# Altium project TFTAdapter v1.PrjPCB
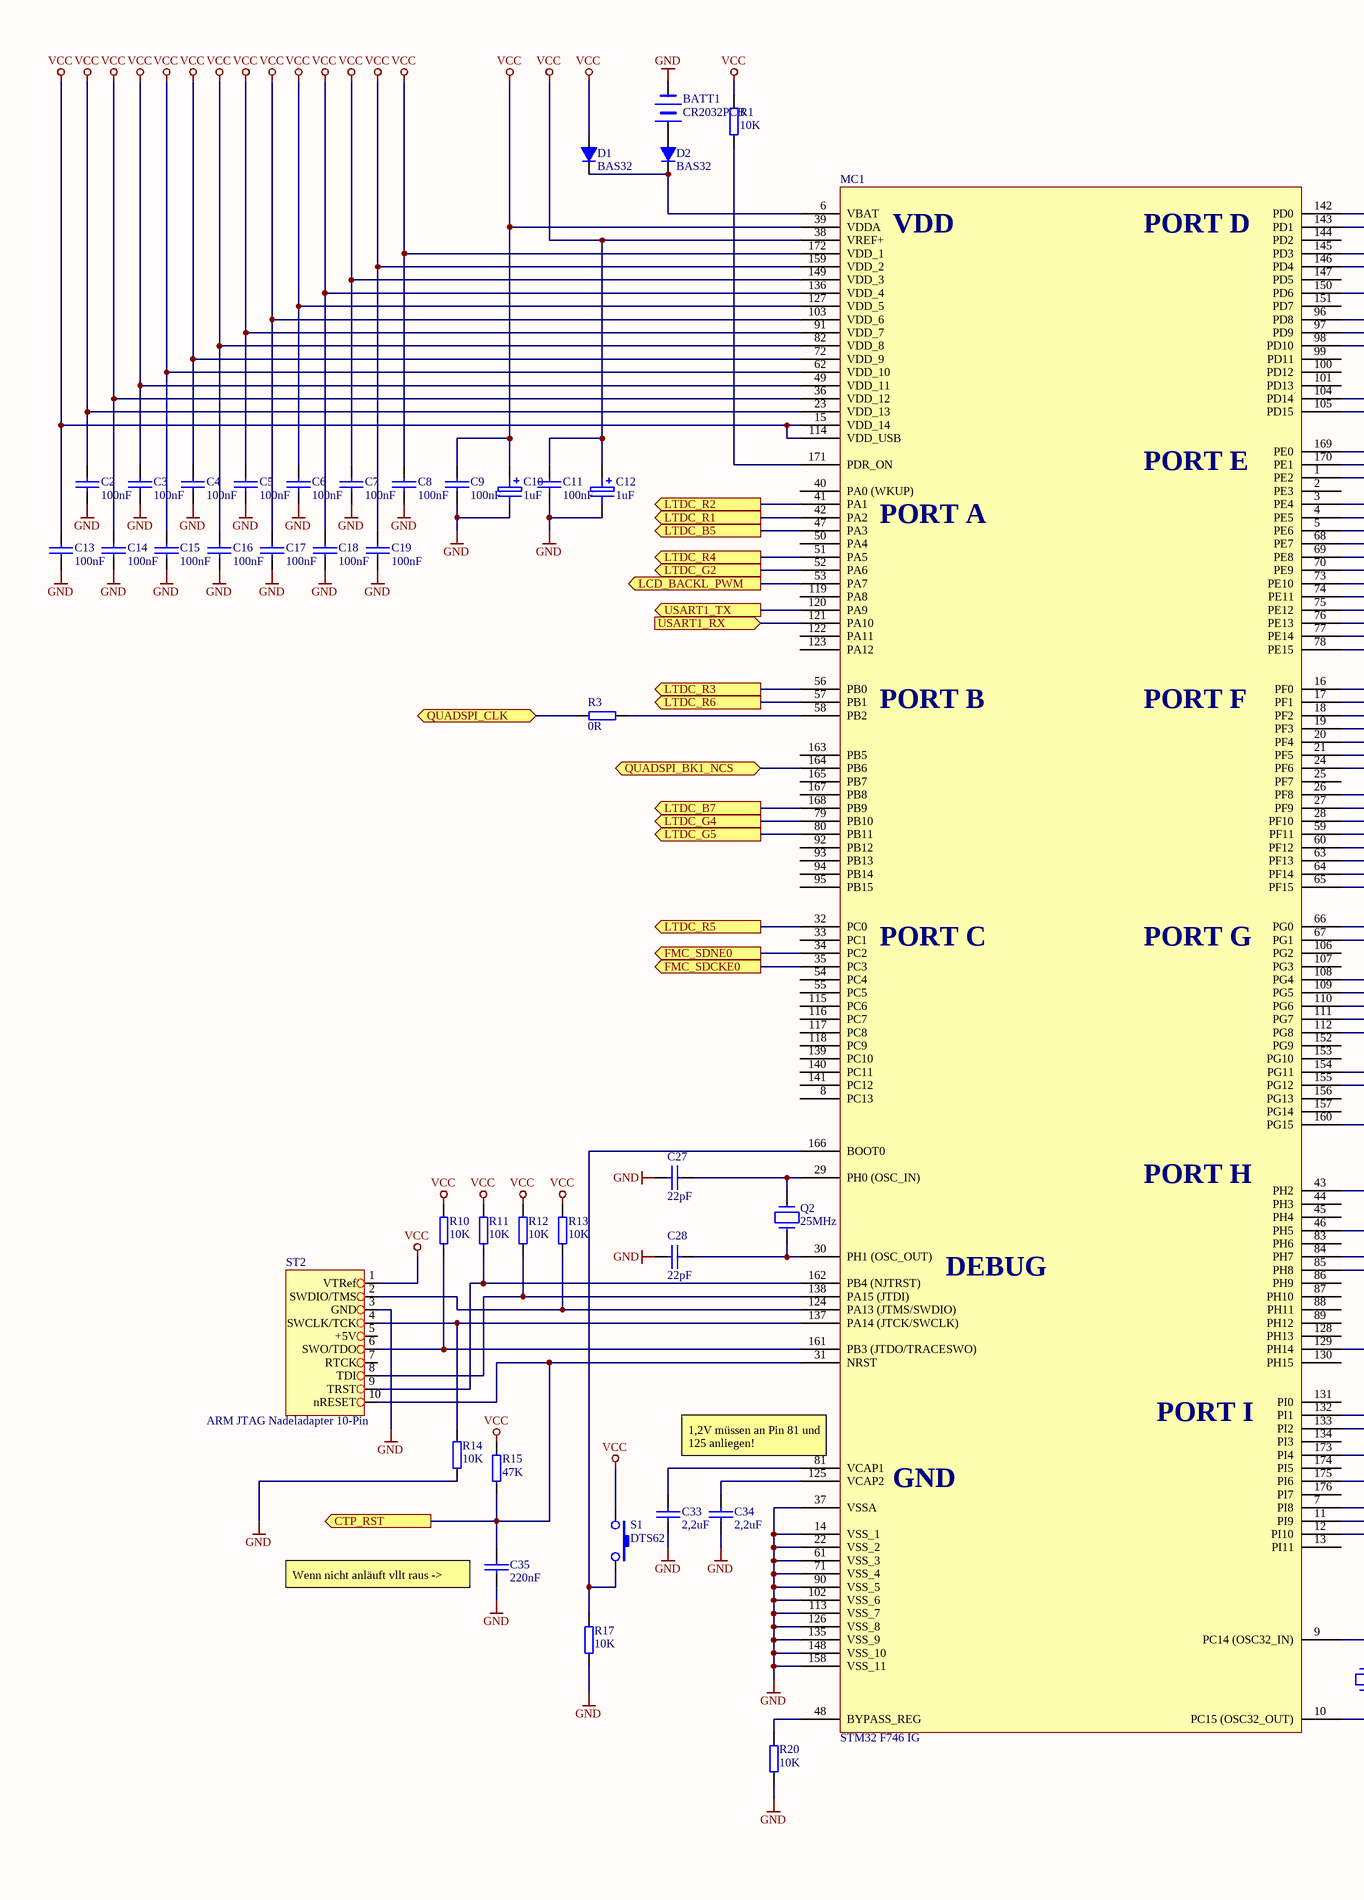
[diagram p0: Prozessor.SchDoc, left]
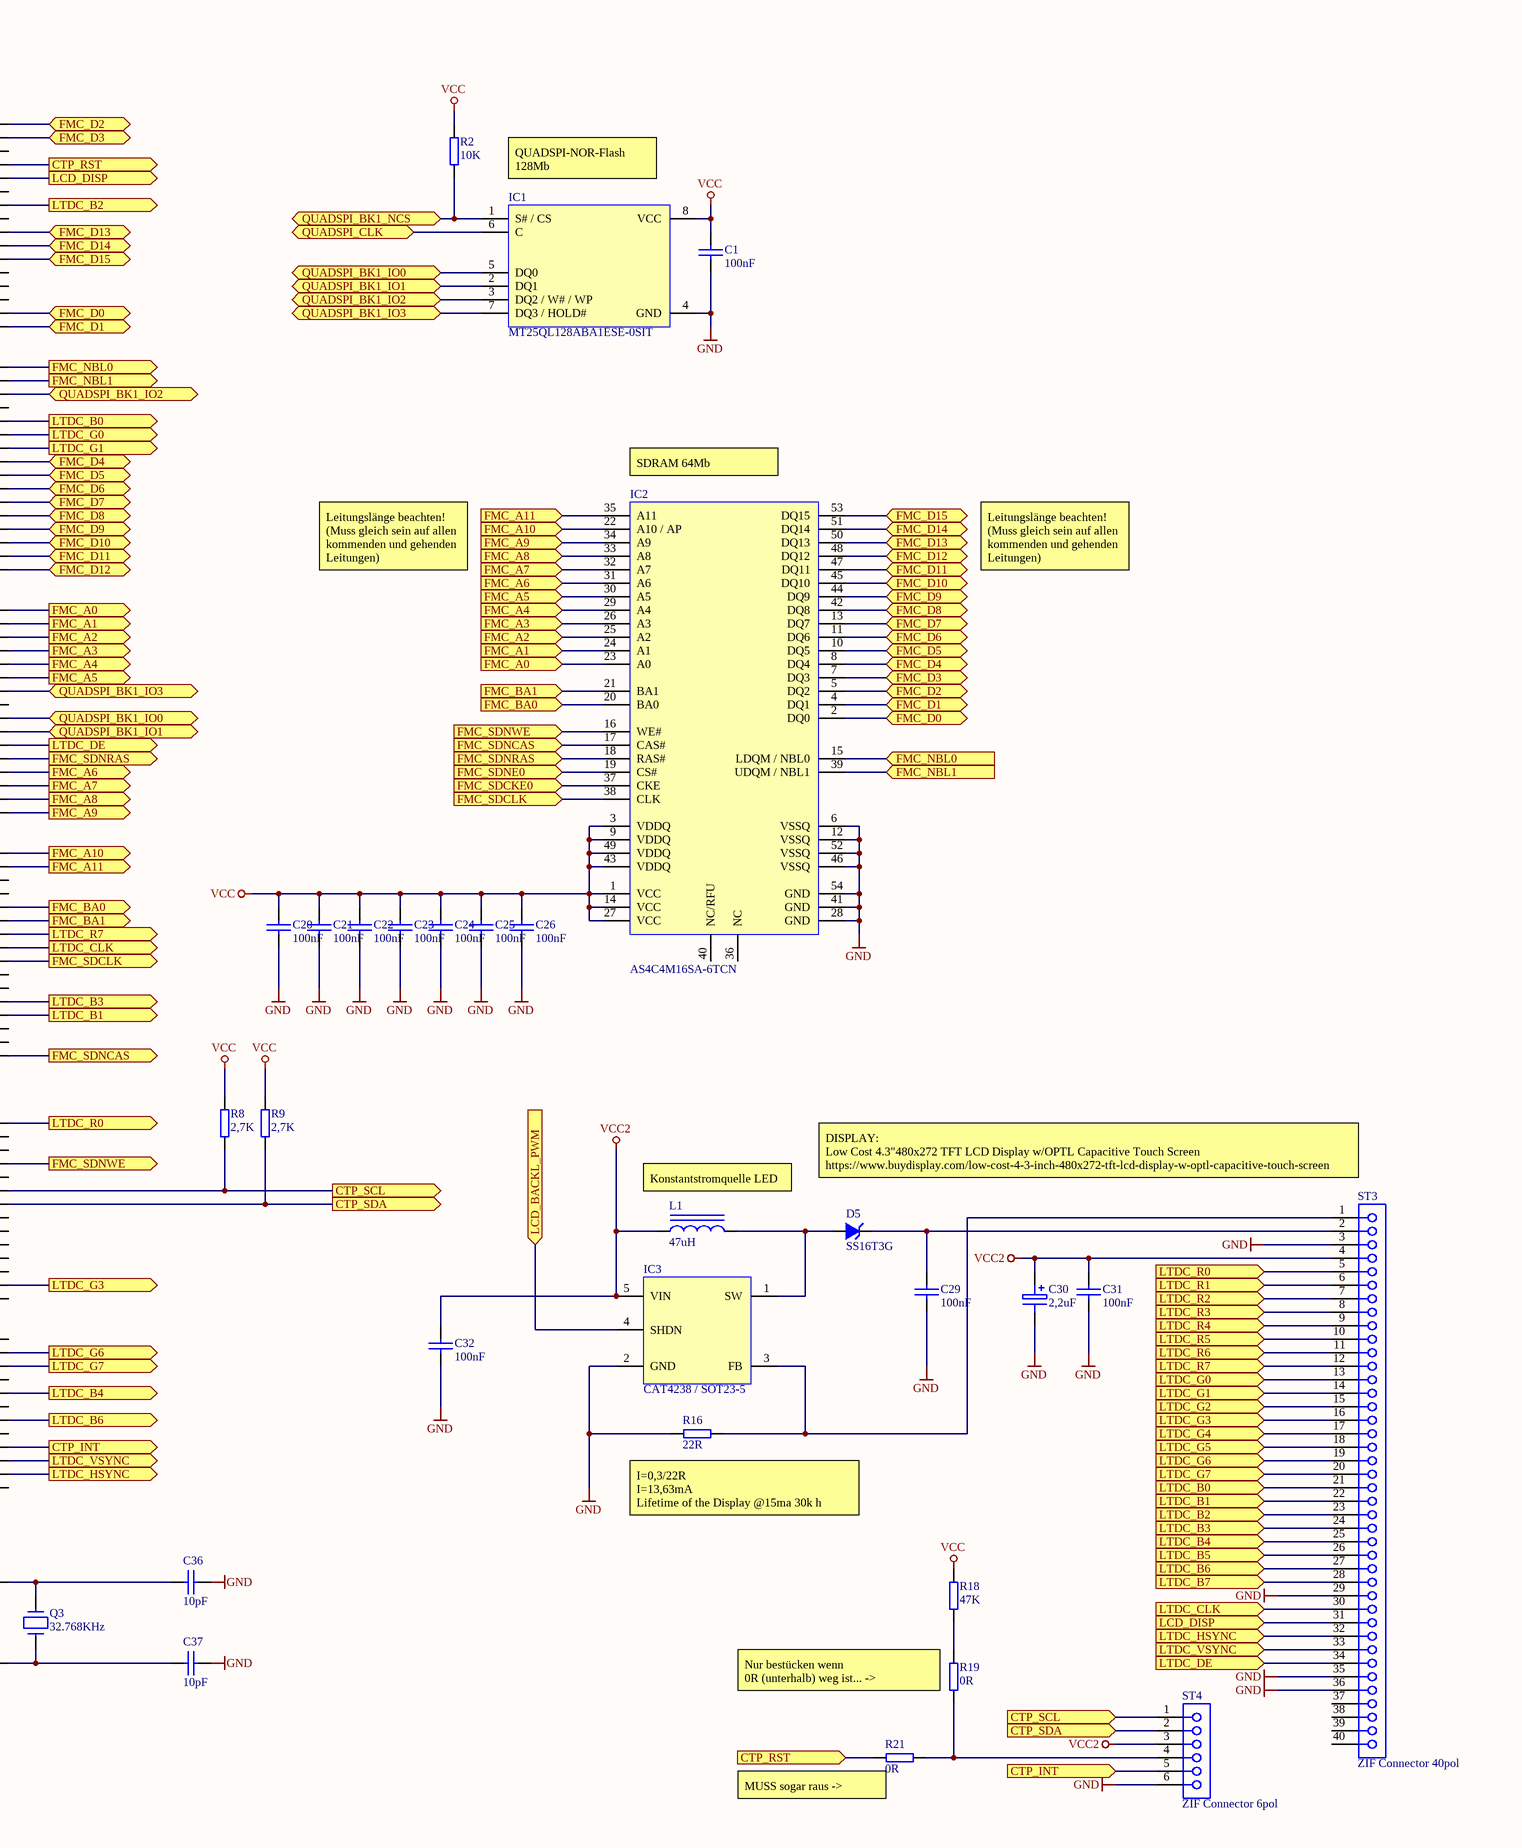
[diagram p1: Prozessor.SchDoc, right]
2 sheets, 71 parts. Net scope: global (net labels, ports and power ports of the same name join across sheets).
Board file: TFTAdapter Version 3.PcbDoc
Sheets:
  Prozessor.SchDoc
  Spannungsversorgung.SchDoc

## Sheet Prozessor.SchDoc
size A2

### Parts
BATT1  CR2032PCB  [KnopfzellenhalterCR2032]
C1  100nF  [C0603]
C2  100nF  [C0603]
C3  100nF  [C0603]
C4  100nF  [C0603]
C5  100nF  [C0603]
C6  100nF  [C0603]
C7  100nF  [C0603]
C8  100nF  [C0603]
C9  100nF  [C0603]
C10  1uF  [Alu-Elko4x5]
C11  100nF  [C0603]
C12  1uF  [Alu-Elko4x5]
C13  100nF  [C0603]
C14  100nF  [C0603]
C15  100nF  [C0603]
C16  100nF  [C0603]
C17  100nF  [C0603]
C18  100nF  [C0603]
C19  100nF  [C0603]
C20  100nF  [C0603]
C21  100nF  [C0603]
C22  100nF  [C0603]
C23  100nF  [C0603]
C24  100nF  [C0603]
C25  100nF  [C0603]
C26  100nF  [C0603]
C27  22pF  [C0603]
C28  22pF  [C0603]
C29  100nF  [C0603]
C30  2,2uF  [CB]
C31  100nF  [C0603]
C32  100nF  [C0603]
C33  2,2uF  [C1206]
C34  2,2uF  [C1206]
C35  220nF  [C0603]
C36  10pF  [C0603]
C37  10pF  [C0603]
D1  BAS32  [Minimelf]
D2  BAS32  [Minimelf]
D5  SS16T3G  [DO214AC/SMA]
IC1  MT25QL128ABA1ESE-0SIT  [SOP2-8-208 (SO8W)]
IC2  AS4C4M16SA-6TCN  [TSSOP(2)54]
IC3  CAT4238 / SOT23-5  [SOT23-5]
L1  47uH  [P8X9]
MC1  STM32 F746 IG  [QFP24x24-176-05]
Q2  25MHz  [HC49S4SMD]
Q3  32.768KHz  [SMD Uhrenquarz klein]
R1  10K  [R0603]
R2  10K  [R0603]
R3  0R  [R0603]
R8  2,7K  [R0603]
R9  2,7K  [R0603]
R10  10K  [R0603]
R11  10K  [R0603]
R12  10K  [R0603]
R13  10K  [R0603]
R14  10K  [R0603]
R15  47K  [R0603]
R16  22R  [R0603]
R17  10K  [R0603]
R18  47K  [R0603]
R19  0R  [R0603]
R20  10K  [R0603]
R21  0R  [R0603]
S1  DTS62  [DTS62]
ST2  ARM JTAG Nadeladapter 10-Pin  [NADELADAPTER-10]
ST3  ZIF Connector 40pol  [ZIF Connector 40pol]
ST4  ZIF Connector 6pol  [ZIF Connector 6pol]

### Ports
CTP_INT (in), CTP_INT (out), CTP_RST (in), CTP_RST (out), CTP_SCL (in), CTP_SCL (out), CTP_SDA (in), CTP_SDA (out), FMC_A0 (in), FMC_A0 (out), FMC_A1 (in), FMC_A1 (out), FMC_A2 (in), FMC_A2 (out), FMC_A3 (in), FMC_A3 (out), FMC_A4 (in), FMC_A4 (out), FMC_A5 (in), FMC_A5 (out), FMC_A6 (in), FMC_A6 (out), FMC_A7 (in), FMC_A7 (out), FMC_A8 (in), FMC_A8 (out), FMC_A9 (in), FMC_A9 (out), FMC_A10 (in), FMC_A10 (out), FMC_A11 (in), FMC_A11 (out), FMC_BA0 (in), FMC_BA0 (out), FMC_BA1 (in), FMC_BA1 (out), FMC_D0 (bidir), FMC_D1 (bidir), FMC_D2 (bidir), FMC_D3 (bidir), FMC_D4 (bidir), FMC_D5 (bidir), FMC_D6 (bidir), FMC_D7 (bidir), FMC_D8 (bidir), FMC_D9 (bidir), FMC_D10 (bidir), FMC_D11 (bidir), FMC_D12 (bidir), FMC_D13 (bidir), FMC_D14 (bidir), FMC_D15 (bidir), FMC_NBL0 (in), FMC_NBL0 (out), FMC_NBL1 (in), FMC_NBL1 (out), FMC_SDCKE0 (in), FMC_SDCKE0 (out), FMC_SDCLK (in), FMC_SDCLK (out), FMC_SDNCAS (in), FMC_SDNCAS (out), FMC_SDNE0 (in), FMC_SDNE0 (out), FMC_SDNRAS (in), FMC_SDNRAS (out), FMC_SDNWE (in), FMC_SDNWE (out), LCD_BACKL_PWM (in), LCD_BACKL_PWM (out), LCD_DISP (in), LCD_DISP (out), LTDC_B0 (in), LTDC_B0 (out), LTDC_B1 (in), LTDC_B1 (out), LTDC_B2 (in), LTDC_B2 (out), LTDC_B3 (in), LTDC_B3 (out), LTDC_B4 (in), LTDC_B4 (out), LTDC_B5 (in), LTDC_B5 (out), LTDC_B6 (in), LTDC_B6 (out), LTDC_B7 (in), LTDC_B7 (out), LTDC_CLK (in), LTDC_CLK (out), LTDC_DE (in), LTDC_DE (out), LTDC_G0 (in), LTDC_G0 (out), LTDC_G1 (in), LTDC_G1 (out), LTDC_G2 (in), LTDC_G2 (out), LTDC_G3 (in), LTDC_G3 (out), LTDC_G4 (in), LTDC_G4 (out), LTDC_G5 (in), LTDC_G5 (out), LTDC_G6 (in), LTDC_G6 (out), LTDC_G7 (in), LTDC_G7 (out), LTDC_HSYNC (in), LTDC_HSYNC (out), LTDC_R0 (in), LTDC_R0 (out), LTDC_R1 (in), LTDC_R1 (out), LTDC_R2 (in), LTDC_R2 (out), LTDC_R3 (in), LTDC_R3 (out), LTDC_R4 (in), LTDC_R4 (out), LTDC_R5 (in), LTDC_R5 (out), LTDC_R6 (in), LTDC_R6 (out), LTDC_R7 (in), LTDC_R7 (out), LTDC_VSYNC (in), LTDC_VSYNC (out), QUADSPI_BK1_IO0 (bidir), QUADSPI_BK1_IO1 (bidir), QUADSPI_BK1_IO2 (bidir), QUADSPI_BK1_IO3 (bidir), QUADSPI_BK1_NCS (bidir), QUADSPI_CLK (bidir), USART1_RX (in), USART1_TX (out)

### Nets
GND: BATT1.1(-) C1.1 C2.1 C3.1 C4.1 C5.1 C6.1 C7.1 C8.1 C9.1 C10.2 C11.1 C12.2 C13.1 C14.1 C15.1 C16.1 C17.1 C18.1 C19.1 C20.1 C21.1 C22.1 C23.1 C24.1 C25.1 C26.1 C27.1 C28.1 C29.1 C30.1(K) C31.1 C32.1 C33.2 C34.2 C35.1 C36.2 C37.2 IC1.4(GND) IC2.6(VSSQ) IC2.12(VSSQ) IC2.28(GND) IC2.41(GND) IC2.46(VSSQ) IC2.52(VSSQ) IC2.54(GND) IC3.2(GND) MC1.14(VSS_1) MC1.22(VSS_2) MC1.37(VSSA) MC1.61(VSS_3) MC1.71(VSS_4) MC1.90(VSS_5) MC1.102(VSS_6) MC1.113(VSS_7) MC1.126(VSS_8) MC1.135(VSS_9) MC1.148(VSS_10) MC1.158(VSS_11) R14.1 R16.1 R17.1 R20.1 ST2.3(GND) ST3.3 ST3.29 ST3.35 ST3.36 ST4.6
VCC: C1.2 C2.2 C3.2 C4.2 C5.2 C6.2 C7.2 C8.2 C9.2 C10.1 C11.2 C12.1 C13.2 C14.2 C15.2 C16.2 C17.2 C18.2 C19.2 C20.2 C21.2 C22.2 C23.2 C24.2 C25.2 C26.2 D1.A IC1.8(VCC) IC2.1(VCC) IC2.3(VDDQ) IC2.9(VDDQ) IC2.14(VCC) IC2.27(VCC) IC2.43(VDDQ) IC2.49(VDDQ) MC1.15(VDD_14) MC1.23(VDD_13) MC1.36(VDD_12) MC1.38(VREF+) MC1.39(VDDA) MC1.49(VDD_11) MC1.62(VDD_10) MC1.72(VDD_9) MC1.82(VDD_8) MC1.91(VDD_7) MC1.103(VDD_6) MC1.114(VDD_USB) MC1.127(VDD_5) MC1.136(VDD_4) MC1.149(VDD_3) MC1.159(VDD_2) MC1.172(VDD_1) R1.2 R2.2 R8.2 R9.2 R10.2 R11.2 R12.2 R13.2 R15.2 R18.2 S1.1 ST2.1(VTRef)
VCC2: C30.2(A) C31.2 C32.2 IC3.5(VIN) L1.1 ST3.4 ST4.3
NetBATT1_2: BATT1.2(+) D2.A
NetC27_2: C27.2 MC1.29(PH0_(OSC_IN)) Q2.2
NetC28_2: C28.2 MC1.30(PH1_(OSC_OUT)) Q2.1
NetC29_2: C29.2 D5.2(K) ST3.2
NetC33_1: C33.1 MC1.81(VCAP1)
NetC34_1: C34.1 MC1.125(VCAP2)
NetC35_2: C35.2 MC1.31(NRST) MC1.145(PD3) R15.1 R21.1 ST2.10(nRESET) ; port CTP_RST
NetC36_1: C36.1 MC1.9(PC14_(OSC32_IN)) Q3.2
NetC37_1: C37.1 MC1.10(PC15_(OSC32_OUT)) Q3.1
NetD1_K: D1.K D2.K MC1.6(VBAT)
NetD5_1: D5.1(A) IC3.1(SW) L1.2
NetIC1_1: IC1.1(S#_/_CS) MC1.164(PB6) R2.1 ; port QUADSPI_BK1_NCS
NetIC1_2: IC1.2(DQ1) MC1.27(PF9) ; port QUADSPI_BK1_IO1
NetIC1_3: IC1.3(DQ2_/_W#_/_WP) MC1.1(PE2) ; port QUADSPI_BK1_IO2
NetIC1_5: IC1.5(DQ0) MC1.26(PF8) ; port QUADSPI_BK1_IO0
NetIC1_6: IC1.6(C) R3.1 ; port QUADSPI_CLK
NetIC1_7: IC1.7(DQ3_/_HOLD#) MC1.24(PF6) ; port QUADSPI_BK1_IO3
NetIC2_2: IC2.2(DQ0) MC1.104(PD14) ; port FMC_D0
NetIC2_4: IC2.4(DQ1) MC1.105(PD15) ; port FMC_D1
NetIC2_5: IC2.5(DQ2) MC1.142(PD0) ; port FMC_D2
NetIC2_7: IC2.7(DQ3) MC1.143(PD1) ; port FMC_D3
NetIC2_8: IC2.8(DQ4) MC1.68(PE7) ; port FMC_D4
NetIC2_10: IC2.10(DQ5) MC1.69(PE8) ; port FMC_D5
NetIC2_11: IC2.11(DQ6) MC1.70(PE9) ; port FMC_D6
NetIC2_13: IC2.13(DQ7) MC1.73(NC) ; port FMC_D7
NetIC2_15: IC2.15(LDQM_/_NBL0) MC1.169(PE0) ; port FMC_NBL0
NetIC2_16: IC2.16(WE#) MC1.46(PH5) ; port FMC_SDNWE
NetIC2_17: IC2.17(CAS#) MC1.160(PG15) ; port FMC_SDNCAS
NetIC2_18: IC2.18(RAS#) MC1.59(PF11) ; port FMC_SDNRAS
NetIC2_19: IC2.19(CS#) MC1.34(PC2) ; port FMC_SDNE0
NetIC2_20: IC2.20(BA0) MC1.108(PG4) ; port FMC_BA0
NetIC2_21: IC2.21(BA1) MC1.109(PG5) ; port FMC_BA1
NetIC2_22: IC2.22(A10_/_AP) MC1.66(PG0) ; port FMC_A10
NetIC2_23: IC2.23(A0) MC1.16(PF0) ; port FMC_A0
NetIC2_24: IC2.24(A1) MC1.17(PF1) ; port FMC_A1
NetIC2_25: IC2.25(A2) MC1.18(PF2) ; port FMC_A2
NetIC2_26: IC2.26(A3) MC1.19(PF3) ; port FMC_A3
NetIC2_29: IC2.29(A4) MC1.20(PF4) ; port FMC_A4
NetIC2_30: IC2.30(A5) MC1.21(PF5) ; port FMC_A5
NetIC2_31: IC2.31(A6) MC1.60(PF12) ; port FMC_A6
NetIC2_32: IC2.32(A7) MC1.63(PF13) ; port FMC_A7
NetIC2_33: IC2.33(A8) MC1.64(PF14) ; port FMC_A8
NetIC2_34: IC2.34(A9) MC1.65(PF15) ; port FMC_A9
NetIC2_35: IC2.35(A11) MC1.67(PG1) ; port FMC_A11
NetIC2_37: IC2.37(CKE) MC1.35(PC3) ; port FMC_SDCKE0
NetIC2_38: IC2.38(CLK) MC1.112(PG8) ; port FMC_SDCLK
NetIC2_39: IC2.39(UDQM_/_NBL1) MC1.170(PE1) ; port FMC_NBL1
NetIC2_42: IC2.42(DQ8) MC1.74(PE11) ; port FMC_D8
NetIC2_44: IC2.44(DQ9) MC1.75(PE12) ; port FMC_D9
NetIC2_45: IC2.45(DQ10) MC1.76(PE13) ; port FMC_D10
NetIC2_47: IC2.47(DQ11) MC1.77(PE14) ; port FMC_D11
NetIC2_48: IC2.48(DQ12) MC1.78(PE15) ; port FMC_D12
NetIC2_50: IC2.50(DQ13) MC1.96(PD8) ; port FMC_D13
NetIC2_51: IC2.51(DQ14) MC1.97(PD9) ; port FMC_D14
NetIC2_53: IC2.53(DQ15) MC1.98(PD10) ; port FMC_D15
NetIC3_3: IC3.3(FB) R16.2 ST3.1
NetIC3_4: IC3.4(SHDN) MC1.53(PA7) ; port LCD_BACKL_PWM
NetJ1_9: MC1.121(PA10) ; port USART1_RX
NetJ1_10: MC1.120(PA9) ; port USART1_TX
NetMC1_3: MC1.3(PE4) ST3.21 ; port LTDC_B0
NetMC1_4: MC1.4(PE5) ST3.13 ; port LTDC_G0
NetMC1_5: MC1.5(PE6) ST3.14 ; port LTDC_G1
NetMC1_7: MC1.7(PI8) ST4.5 ; port CTP_INT
NetMC1_11: MC1.11(PI9) ST3.33 ; port LTDC_VSYNC
NetMC1_12: MC1.12(PI10) ST3.32 ; port LTDC_HSYNC
NetMC1_28: MC1.28(PF10) ST3.34 ; port LTDC_DE
NetMC1_32: MC1.32(PC0) ST3.10 ; port LTDC_R5
NetMC1_41: MC1.41(PA1) ST3.7 ; port LTDC_R2
NetMC1_42: MC1.42(PA2) ST3.6 ; port LTDC_R1
NetMC1_43: MC1.43(PH2) ST3.5 ; port LTDC_R0
NetMC1_47: MC1.47(PA3) ST3.26 ; port LTDC_B5
NetMC1_48: MC1.48(BYPASS_REG) R20.2
NetMC1_51: MC1.51(PA5) ST3.9 ; port LTDC_R4
NetMC1_52: MC1.52(PA6) ST3.15 ; port LTDC_G2
NetMC1_56: MC1.56(PB0) ST3.8 ; port LTDC_R3
NetMC1_57: MC1.57(PB1) ST3.11 ; port LTDC_R6
NetMC1_58: MC1.58(PB2) R3.2
NetMC1_79: MC1.79(PB10) ST3.17 ; port LTDC_G4
NetMC1_80: MC1.80(PB11) ST3.18 ; port LTDC_G5
NetMC1_84: MC1.84(PH7) R8.1 ST4.1 ; port CTP_SCL
NetMC1_85: MC1.85(PH8) R9.1 ST4.2 ; port CTP_SDA
NetMC1_110: MC1.110(PG6) ST3.12 ; port LTDC_R7
NetMC1_111: MC1.111(PG7) ST3.30 ; port LTDC_CLK
NetMC1_124: MC1.124(PA13_(JTMS/SWDIO)) R13.1 ST2.2(SWDIO/TMS)
NetMC1_129: MC1.129(PH14) ST3.16 ; port LTDC_G3
NetMC1_132: MC1.132(PI1) ST3.19 ; port LTDC_G6
NetMC1_133: MC1.133(PI2) ST3.20 ; port LTDC_G7
NetMC1_137: MC1.137(PA14_(JTCK/SWCLK)) R14.2 ST2.4(SWCLK/TCK)
NetMC1_138: MC1.138(PA15_(JTDI)) R12.1 ST2.8(TDI)
NetMC1_146: MC1.146(PD4) ST3.31 ; port LCD_DISP
NetMC1_150: MC1.150(PD6) ST3.23 ; port LTDC_B2
NetMC1_154: MC1.154(PG11) ST3.24 ; port LTDC_B3
NetMC1_155: MC1.155(PG12) ST3.22 ; port LTDC_B1
NetMC1_161: MC1.161(PB3_(JTDO/TRACESWO)) R10.1 ST2.6(SWO/TDO)
NetMC1_162: MC1.162(PB4_(NJTRST)) R11.1 ST2.9(TRST)
NetMC1_166: MC1.166(BOOT0) R17.2 S1.3
NetMC1_168: MC1.168(PB9) ST3.28 ; port LTDC_B7
NetMC1_171: MC1.171(PDR_ON) R1.1
NetMC1_173: MC1.173(PI4) ST3.25 ; port LTDC_B4
NetMC1_175: MC1.175(PI6) ST3.27 ; port LTDC_B6
NetR18_1: R18.1 R19.2
NetR19_1: R19.1 R21.2 ST4.4

Not connected (* = marked no-connect by the designer): IC2 36(NC) 40(NC/RFU); MC1 2(PE3) 8(PC13) 13(PI11) 25(PF7) 33(PC1) 40(PA0_(WKUP)) 44(PH3) 45(PH4) 50(PA4) 54(PC4) 55(PC5) 83(PH6) 86(PH9) 87(PH10) 88(PH11) 89(PH12) 92(PB12) 93(PB13) 94(PB14) 95(PB15) 99(PD11) 100(PD12) 101(PD13) 106(PG2) 107(PG3) 115(PC6) 116(PC7) 117(PC8) 118(PC9) 119(PA8) 122(PA11) 123(PA12) 128(PH13) 130(PH15) 131(PI0) 134(PI3) 139(PC10) 140(PC11) 141(PC12) 144(PD2) 147(PD5) 151(PD7) 152(PG9) 153(PG10) 156(PG13) 157(PG14) 163(PB5) 165(PB7) 167(PB8) 174(PI5) 176(PI7); ST2 5(+5V) 7(RTCK); ST3 37 38 39 40

### Notes on the sheet
- QUADSPI-NOR-Flash 128Mb
- (near IC2) SDRAM 64Mb
- Leitungslänge beachten!
  (Muss gleich sein auf allen kommenden und gehenden Leitungen)
- (near L1) Konstantstromquelle LED
- DISPLAY:
  Low Cost 4.3"480x272 TFT LCD Display w/OPTL Capacitive Touch Screen
  https://www.buydisplay.com/low-cost-4-3-inch-480x272-tft-lcd-display-w-optl-capacitive-touch-screen
- (near MC1) 1,2V müssen an Pin 81 und 125 anliegen!
- (near C35) Wenn nicht anläuft vllt raus ->
- (near R16) I=0,3/22R
  I=13,63mA
  Lifetime of the Display @15ma 30k h
- (near R19) Nur bestücken wenn
  0R (unterhalb) weg ist... ->
- (near R21) MUSS sogar raus ->
- Title
- Size:
- Date:
- File:
- A2
- Number:
- Time:
- Revision:
- Sheet
- of
- (in symbol STM32 F746 IG) VDD; PORT D; PORT E; PORT A; PORT B; PORT F; PORT C; PORT G; PORT H; DEBUG; PORT I; GND

### Library data of the parts
BATT1 = CR2032 / HALTER: Knopfzellenhalter für Lithium-Batterie CR2032
C1-C9 C11 C13-C26 C29 C31 C32 = 0603 / 100nF: 100nF 0603 SMD-Keramik X7R 10% 50V
C10 C12 = 1uF / 50V: SMD-Alu Elko 1uF / 50V
C27 C28 = 0603 / 22pF: 22pF 0603 SMD-Keramik X7R 10% 50V
C30 = 2,2uF / 25V: SMD-Tantal 2,2uF / 25V 20% B
C33 C34 = 1206 / 2,2uF: 2,2uF 1206 SMD-Keramik 10% 50V XR7
C35 = 0603 / 220nF: 220nF 0603 SMD-Keramik X7R 10% 50V
C36 C37 = 0603 / 10pF: 10pF 0603 SMD-Keramik X7R 10% 50V
D1 D2 = BAS32 / MINIMELF: SMD Si-Diode 100V 0,2A Minimelf
D5 = SS16T3G: Schottky Diode 60V 1A
IC1 = MT25QL128ABA1ESE-0SIT / SO8W: SPI-NOR-Flash 128Mb
IC2 = AS4C4M16SA-6TCN / SO8W_1: SDRAM 64Mb
IC3 = CAT4238 / SOT23-5: LED Driver, Boost, 10LED
L1 = 47uH / P8X9: Tonneninduktivität stehend
MC1 = STM32 F746 IG: LQFP 1176 24x24
Q2 = HC49 S / 8: SMD Schwingquarz 8MHz HC49S$SMD 30ppm
Q3 = ZM315-32.768: SMD Schwingquarz 32.768KHz 15ppm
R1 R2 R10-R14 R17 R20 = 0603 / 10K: 10K 0603 SMD-Kohleschicht 1% 0,1W
R3 R19 R21 = 0603 / 0R: 0R 0603 SMD-Kohleschicht 1% 0,1W
R8 R9 = 0603 / 2,7K: 2,7K 0603 SMD-Kohleschicht 1% 0,1W
R15 R18 = 0603 / 47K: 47K 0603 SMD-Kohleschicht 1% 0,1W
R16 = 0603 / 22R: 22R 0603 SMD-Kohleschicht 1% 0,1W
S1 = DTS62 / N: Leiterplattentaster 6x6mm 1,6N
ST3 = ZIF Connector 40pol Top Contact
ST4 = ZIF Connector 6pol Top Contact

## Sheet Spannungsversorgung.SchDoc
size A4
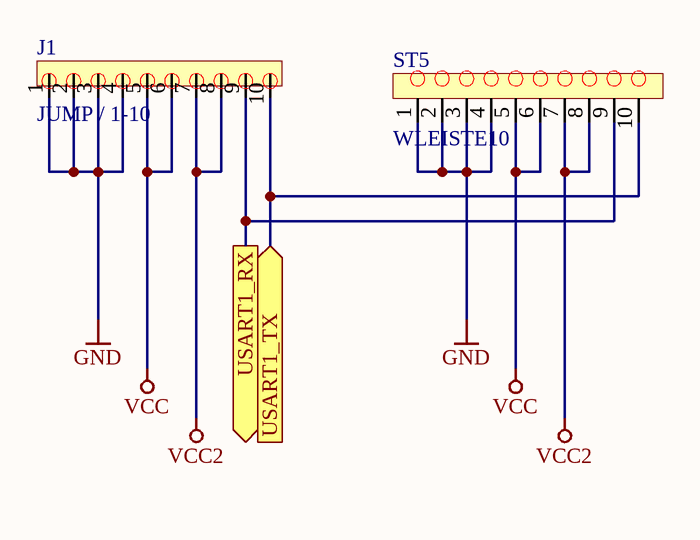
[diagram p2: Spannungsversorgung.SchDoc]

### Parts
J1  JUMP / 1-10  [JUMPER1/10]
ST5  WLEISTE10  [WLEISTE10_GERADE]

### Ports
USART1_RX (out), USART1_TX (in)

### Nets
GND: J1.1 J1.2 J1.3 J1.4 ST5.1 ST5.2 ST5.3 ST5.4
VCC: J1.5 J1.6 ST5.5 ST5.6
VCC2: J1.7 J1.8 ST5.7 ST5.8
NetJ1_9: J1.9 ST5.9 ; port USART1_RX
NetJ1_10: J1.10 ST5.10 ; port USART1_TX

### Library data of the parts
J1 = JUMP / 1-10: Stiftleiste 10polig RM2,54
ST5 = WLEISTE10: Wannenleiste 10polig

## Nets that join several sheets
GND: Prozessor (69 pins), Spannungsversorgung (8 pins)
VCC: Prozessor (64 pins), Spannungsversorgung (J1.5 J1.6 ST5.5 ST5.6)
VCC2: Prozessor (7 pins), Spannungsversorgung (J1.7 J1.8 ST5.7 ST5.8)
NetJ1_9: Prozessor (MC1.121), Spannungsversorgung (J1.9 ST5.9)
NetJ1_10: Prozessor (MC1.120), Spannungsversorgung (J1.10 ST5.10)